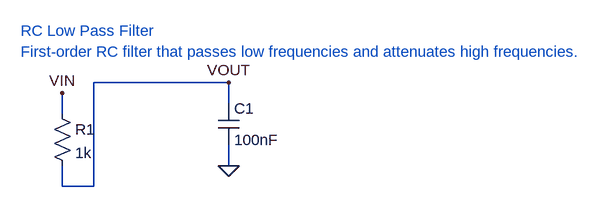
[diagram p0: schematic rc_low_pass_filter.asc]
rc_low_pass_filter.asc, the LTspice schematic file:
Version 4
SHEET 1 1200 800
TEXT 16 16 Left 2 ;RC Low Pass Filter
TEXT 16 48 Left 2 ;First-order RC filter that passes low frequencies and attenuates high frequencies.
SYMBOL res 64 128 R0
SYMATTR InstName R1
SYMATTR Value 1k
SYMBOL cap 320 128 R0
SYMATTR InstName C1
SYMATTR Value 100nF
FLAG 80 112 VIN
WIRE 80 112 80 144
FLAG 336 96 VOUT
WIRE 80 224 80 256
WIRE 80 256 128 256
WIRE 128 96 128 256
WIRE 128 96 336 96
WIRE 336 96 336 128
FLAG 336 224 0
WIRE 336 192 336 224

The netlist it stands for:
* rc_low_pass_filter.asc
R1 VIN VOUT 1k
C1 VOUT 0 100nF
* RC Low Pass Filter
* First-order RC filter that passes low frequencies and attenuates high frequencies.
.backanno
.end